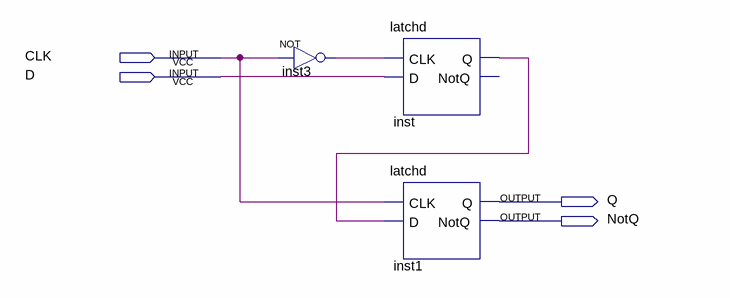
[diagram p0: schematic sheet]
// Quartus schematic flipflop.bdf as structural Verilog: 3 symbols, 4 pins
module flipflop (
  input  CLK,
  input  D,
  output Q,
  output NotQ
);

  wire inst3_out, inst_q;

  not inst3 (inst3_out, CLK);
  latchd inst (.CLK(inst3_out), .D(D), .Q(inst_q));  // open: NotQ
  latchd inst1 (.CLK(CLK), .D(inst_q), .Q(Q), .NotQ(NotQ));
endmodule
